# Altium project Regulator.PrjPcb
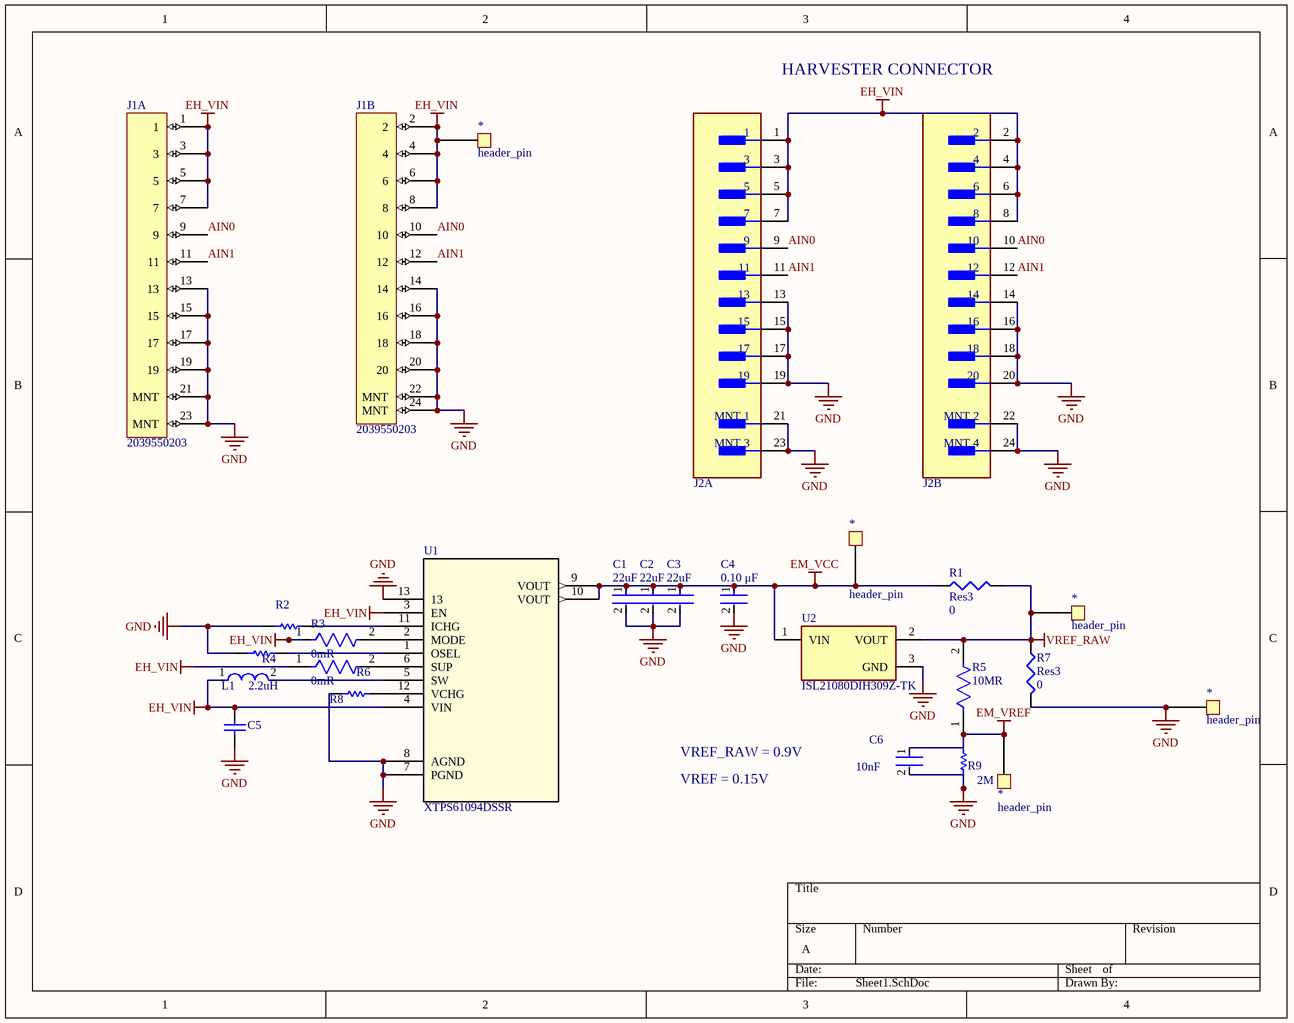
[diagram p0: Sheet1.SchDoc]
1 sheet, 25 parts. Net scope: global (net labels, ports and power ports of the same name join across sheets).
Board file: PCB1.PcbDoc

## Sheet Sheet1.SchDoc
size A; SheetNumber: 1; SheetTotal: 1

### Parts
C1  Capacitance: 22uF  [FP-CL05A226MQ5N6J8-IPC_C]  (hidden comment: 04024D226MAT2A)
C2  Capacitance: 22uF  [FP-CL05A226MQ5N6J8-IPC_C]  (hidden comment: 04024D226MAT2A)
C3  Capacitance: 22uF  [FP-CL05A226MQ5N6J8-IPC_C]  (hidden comment: 04024D226MAT2A)
C4  Capacitance: 0.10 μF  [FP-C0402-BB-MFG]  (hidden comment: C0402C104K8PACTU)
C5  C0402C225M9PACTU  [CAPC1005X55X30NL05T10]  (value not drawn)
C6  Capacitance: 10nF  [FP-GRM155-0_05-IPC_C]  (hidden comment: GRM155R71H103KA88D)
EH_VIN  header_pin  [1mm_header]
EM_VCC  header_pin  [1mm_header]
EM_VREF  header_pin  [1mm_header]
GND  header_pin  [1mm_header]
J1  2039550203  [2039550203]  (parts A,B of 2)
J2  2039560203  [Molex_0_MFG]  (value not drawn)  (parts A,B of 2)
L1  Inductance: 2.2uH  [FP-LQM21PH_G0-IPC_C]  (hidden comment: LQM21PN2R2NGCD)
R1  Res3  value 0  [J1-0603]
R2  RC0402JR-070RL  [RESC1005X40X25NL05T10]  (value not drawn)
R3  Resistance: 0mR  [FP-CRCW0402-e3-IPC_C]  (hidden comment: CRCW04020000Z0ED)
R4  RC0402JR-070RL  [RESC1005X40X25NL05T10]  (value not drawn)
R5  Resistance: 10MR  [FP-CRCW0402-e3-IPC_C]  (hidden comment: CRCW040210M0JNED)
R6  Resistance: 0mR  [FP-CRCW0402-e3-IPC_C]  (hidden comment: CRCW04020000Z0ED)
R7  Res3  value 0  [J1-0603]
R8  RC0402JR-070RL  [RESC1005X40X25NL05T10]  (value not drawn)
R9  Resistance: 2M  [RESC1005X40X25LL05T05]  (hidden comment: RMCF0402JT2M00)
U1  XTPS61094DSSR  [WSON_94DSSR_TEX-L]
U2  ISL21080DIH309Z-TK  [Intersil_ISL21080DIH309Z-TK_0]
VREF_RAW  header_pin  [1mm_header]

### Nets
EH_VIN: C5.2 EH_VIN.1 J1.1 J1.2 J1.3 J1.4 J1.5 J1.6 J1.7 J1.8 J2.1 J2.2 J2.3 J2.4 J2.5 J2.6 J2.7 J2.8 L1.1 R3.1 R6.1 U1.3(EN) U1.4(VIN)
EM_VCC: C1.1 C2.1 C3.1 C4.1 EM_VCC.1 R1.1 U1.9(VOUT) U1.10(VOUT) U2.1(VIN)
EM_VREF: C6.1 EM_VREF.1 R5.1 R9.2
GND: C1.2 C2.2 C3.2 C4.2 C5.1 C6.2 GND.1 J1.13 J1.14 J1.15 J1.16 J1.17 J1.18 J1.19 J1.20 J1.21(MNT) J1.22(MNT) J1.23(MNT) J1.24(MNT) J2.13 J2.14 J2.15 J2.16 J2.17 J2.18 J2.19 J2.20 J2.21(MNT_1) J2.22(MNT_2) J2.23(MNT_3) J2.24(MNT_4) R2.1 R4.1 R7.2 R8.1 R9.1 U1.7(PGND) U1.8(AGND) U1.13 U2.3(GND)
VREF_RAW: R1.2 R5.2 R7.1 U2.2(VOUT) VREF_RAW.1
AIN0: J1.9 J1.10 J2.9 J2.10
AIN1: J1.11 J1.12 J2.11 J2.12
NetL1_2: L1.2 U1.5(SW)
NetR2_2: R2.2 U1.11(ICHG)
NetR3_2: R3.2 U1.2(MODE)
NetR4_2: R4.2 U1.1(OSEL)
NetR6_2: R6.2 U1.6(SUP)
NetR8_2: R8.2 U1.12(VCHG)

### Notes on the sheet
- HARVESTER CONNECTOR
- VREF_RAW = 0.9V
- VREF = 0.15V

### Library data of the parts
C1-C3 = CMP-13271-000001-1: CAP CER 22UF 6.3V X5R 0402; Manufacturer Part Number: CL05A226MQ5N6J8; Manufacturer: Samsung Electro-Mechanics; Material: Ceramic; Temperature Coefficient: 15%; Tolerance: 20%; Ipc Land Pattern Name: CAPC10050X50; Lead Free: Yes; Temperature Characteristic: X5R; Temperature: -55°C to +85°C; RoHS: TRUE; ComponentLink2Description: Datasheet; Device Class L3: Ceramic Capacitors; Device Class L1: Passive Components; Value: 22uF; Temperature Range High: +85°C; Automotive: No; Voltage Rating: 6.3V; Package: 0402; Category: Cap; Device Class L2: Capacitors; Height: 0.55mm; ComponentLink2URL: http://www.samsungsem.com/kr/support/library/product-catalog/__icsFiles/afieldfile/2018/11/28/MLCC.pdf; Temperature Range Low: -55°C; Octopart: https://octopart.com/cl05a226mq5n6j8-samsung-82337113; Digikey Description: CAP CER 22UF 6.3V X5R 0402
C4 = CMP-2008-02046-2: CAP CER 0.1UF 10V X5R 0402; Manufacturer: Kemet; Material: Ceramic; Temperature Coefficient: 15%; Tolerance: 0.1; Value: 0.10 μF; Package: C0402-BB; Temperature: -55°C to +125°C; ComponentLink2Description: Datasheet; Temperature Characteristic: X5R; Device Class L1: Passive Components; Height: 0.55mm; Lead Free: Yes; ComponentLink2URL: https://content.kemet.com/datasheets/KEM_C1002_X7R_SMD.pdf; Device Class L2: Capacitors; Temperature Range Low: -55°C; Temperature Range High: +125°C; RoHS: TRUE; Octopart: https://octopart.com/c0402c104k8pactu-kemet-140039; Automotive: No; Mouser Description: Capacitor 100 nF 10 VDC 0402; Category: Cap; Voltage Rating: 10 V; Digikey Description: CAP CER 0.1UF 10V X5R 0402; Ipc Land Pattern Name: CAPC10050X50; Device Class L3: Ceramic Capacitors; Manufacturer Part Number: C0402C104K8PACTU
C5 = CMP-2008-02064-2: Manufacturer: Kemet; Part Number: C0402C225M9PACTU
C6 = CMP-2008-04637-5: Chip Multilayer Ceramic Capacitors for General Purpose, 0402, 10000pF, X7R, 15%, 10%, 50V; Voltage: 25V; Tolerance: 10%; Mount: Surface Mount; Lead Free: Lead Free; Radiation Hardening: No; Case Code (Imperial): 0402; REACH SVHC: No SVHC; Case/Package: 0402; Dielectric: X7R; Voltage Rating (DC): 50V; Max Operating Temperature: 125°C; Termination: SMD/SMT; Material: Ceramic; Width: 0.02inch; Package Quantity: 1; Voltage Rating: 50V; Thickness: 0.022inch; Packaging: Tape and Reel; Height: 0.5mm; Number of Pins: 2; Case Code (Metric): 1005; Min Operating Temperature: -55°C; Length: 1mm; Depth: 0.5mm
J2 = 2039560203: 20 Position Connector Plug, Outer Shroud Contacts Surface Mount Gold; Manufacturer: Molex; Conn Gender: Male; Conn Orientation: Vertical; Current Rating: 0.3A; Is Female: no; Number Of Contacts: 20; Pitch: 0.4mm; Symbol Hash: db22f1623fbfed54a22177e49599976dea34d6b12f98f445fc170047d3fb1d12; Verification Version: 0.0.0.3; Voltage Rating: 40V; Part Number: 2039560203; Datasheet Path: datasheets/Conn_Molex_2039560203_eec.pdf; Automotive: No; ComponentLink1Description: Upverter; ComponentLink1URL: https://upverter.com/part/id/0a58283e91808ac4/; ComponentLink2Description: Datasheet; ComponentLink2URL: https://www.molex.com/webdocs/datasheets/pdf/en-us/2039560203_PCB_HEADERS.pdf; Contact Material: Gold,Nickel; Digikey Description: CONN PLUG 20POS SMD GOLD; Digikey Part Number: 900-2039560203CT-ND; Footprint Url: https://www.molex.com/pdm_docs/sd/2039560203_sd.pdf; Height: 4.55mm; Lead Free: Yes; Mouser Part Number: 538-203956-0203; Number Of Rows: 2; Package: 0; RoHS: TRUE; Supplier 1: Digi-Key; Supplier 2: Mouser; Supplier Part Number 1: 900-2039560203CT-ND; Supplier Part Number 2: 538-203956-0203; Temperature: -40°C to +125°C; Temperature Range High: +125°C; Temperature Range Low: -40°C; helpURL: https://upverter.com/part/id/0a58283e91808ac4/
L1 = CMP-06042-016317-1: Multilayer Type Inductor for Power Lines, 0805 (2012), 2.2μH, 30%, 0.288Ω, 0.8A; Test Frequency: 1MHz; Shielding: Shielded; Current Rating: 800mA; Self Resonant Frequency: 40MHz; Core Material: Ferrite; DC Resistance (DCR): 288mR; RoHS Compliant: Yes; REACH SVHC: No SVHC; Inductance Tolerance: 30%; Package Quantity: 4000; Military Standard: Not; Max Operating Temperature: 125°C; Radiation Hardening: No; Series: LQM; Height - Seated (Max): 0.039inch; Tolerance: 30%; Height: 0.9mm; Lead Free: Lead Free; Case Code (Metric): 2012; Packaging: Tape and Reel; Termination: SMD/SMT; Case Code (Imperial): 0805; Min Operating Temperature: -55°C; Depth: 1.4mm; Mount: Surface Mount; Length: 2mm; DC Current: 800mA; Case/Package: 0805; Max DC Current: 800mA; Width: 0.049inch
R1 R7 = Res3: Resistor; Published: 8-Jun-2000; LatestRevisionDate: 29-May-2009; LatestRevisionNote: IPC-7351 Footprint Added.; PackageReference: J1-0603; Publisher: Altium Limited; PackageDescription: Chip Resistor
R2 R4 R8 = CMP-1011-00001-2: Manufacturer: Yageo / Phycomp; Part Number: RC0402JR-070RL
R3 R6 = CMP-2002-08122-2: RES Thick Film, 0Ω, 0.063W, 0402; Tolerance: 5%; Max Power Dissipation: 63mW; Voltage Rating: 50V; Temperature Coefficient: 100ppm/°C; Contact Plating: Tin; Height: 0.35mm; Radiation Hardening: No; Features: Automotive AEC-Q200; Composition: Thick Film; Width: 0.5mm; Weight: 2.3E-05oz; Termination: SMD/SMT; Packaging: Tape and Reel; Mount: Surface Mount; Case Code (Metric): 1005; Military Standard: Not; Min Operating Temperature: -55°C; Number of Terminations: 2; Package Quantity: 1; Case Code (Imperial): 0402; Depth: 0.5mm; Max Operating Temperature: 155°C; Case/Package: 0402; Power Rating: 63mW; Lead Free: Lead Free; Voltage Rating (DC): 50V; Length: 1mm
R5 = CMP-1011-00170-3: RES Thick Film, 10MΩ, 5%, 0.063W, 200ppm/°C, 0402; Voltage Rating (DC): 50V; Max Power Dissipation: 63mW; Case Code (Metric): 1005; Tolerance: 5%; Lead Free: Lead Free; Length: 1mm; Packaging: Tape and Reel; Depth: 0.5mm; Composition: Thick Film; Temperature Coefficient: 200ppm/°C; Package Quantity: 1; Radiation Hardening: No; Weight: 2.3E-05oz; Width: 0.5mm; Military Standard: Not; Power Rating: 63mW; Case/Package: 0402; Termination: SMD/SMT; Height: 0.016inch; Voltage Rating: 50V; Contact Plating: Tin; Number of Terminations: 2; Features: Automotive AEC-Q200; Max Operating Temperature: 155°C; Case Code (Imperial): 0402; Min Operating Temperature: -55°C
R9 = CMP-1011-00881-2: Manufacturer: Vishay Dale; Part Number: CRCW04022M00FKED
U1 = XTPS61094DSSR: No Description Available; SourceLibrary: Add_to_database_2021-03-17; Built_By: EMA_Matt; Vendor: Texas Instruments; Datasheet: https://www.ti.com/lit/ds/symlink/tps61094.pdf?ts=1615883226162; Manufacturer_Part_Number: XTPS61094DSSR; Copyright: Copyright (C) 2018 Accelerated Designs. All rights reserved; RefDes: RefDes; Type: DEV
U2 = IC_Intersil_ISL21080DIH309Z-TK_eec: IC VREF SERIES 0.9V SOT23-3; Part Number: ISL21080DIH309Z-TK; helpURL: https://upverter.com/upn/revision/cea4d3e56c7c7365/; ComponentLink2Description: Datasheet; Temperature: -40°C to +85°C; Package: SOT23-3; Supplier 2: Mouser; Price: 1.15623202851; Supplier 1: Digi-Key; ComponentLink1URL: https://upverter.com/upn/revision/cea4d3e56c7c7365/; Supplier Part Number 2: 968-ISL21080DIH309ZT; Supplier Part Number 1: ISL21080DIH309Z-TKCT-ND; Manufacturer: Intersil; ComponentLink1Description: Upverter; ComponentLink2URL: https://www.intersil.com/content/dam/Intersil/documents/isl2/isl21080.pdf; RoHS: TRUE; Mouser Part Number: 968-ISL21080DIH309ZT; Temperature Range High: +85°C; Digikey Description: IC VREF SERIES 0.9V SOT23-3; Digikey Part Number: ISL21080DIH309Z-TKCT-ND; Lead Free: yes; Temperature Range Low: -40°C